# Altium schematic sheet P1.SchDoc
size A2
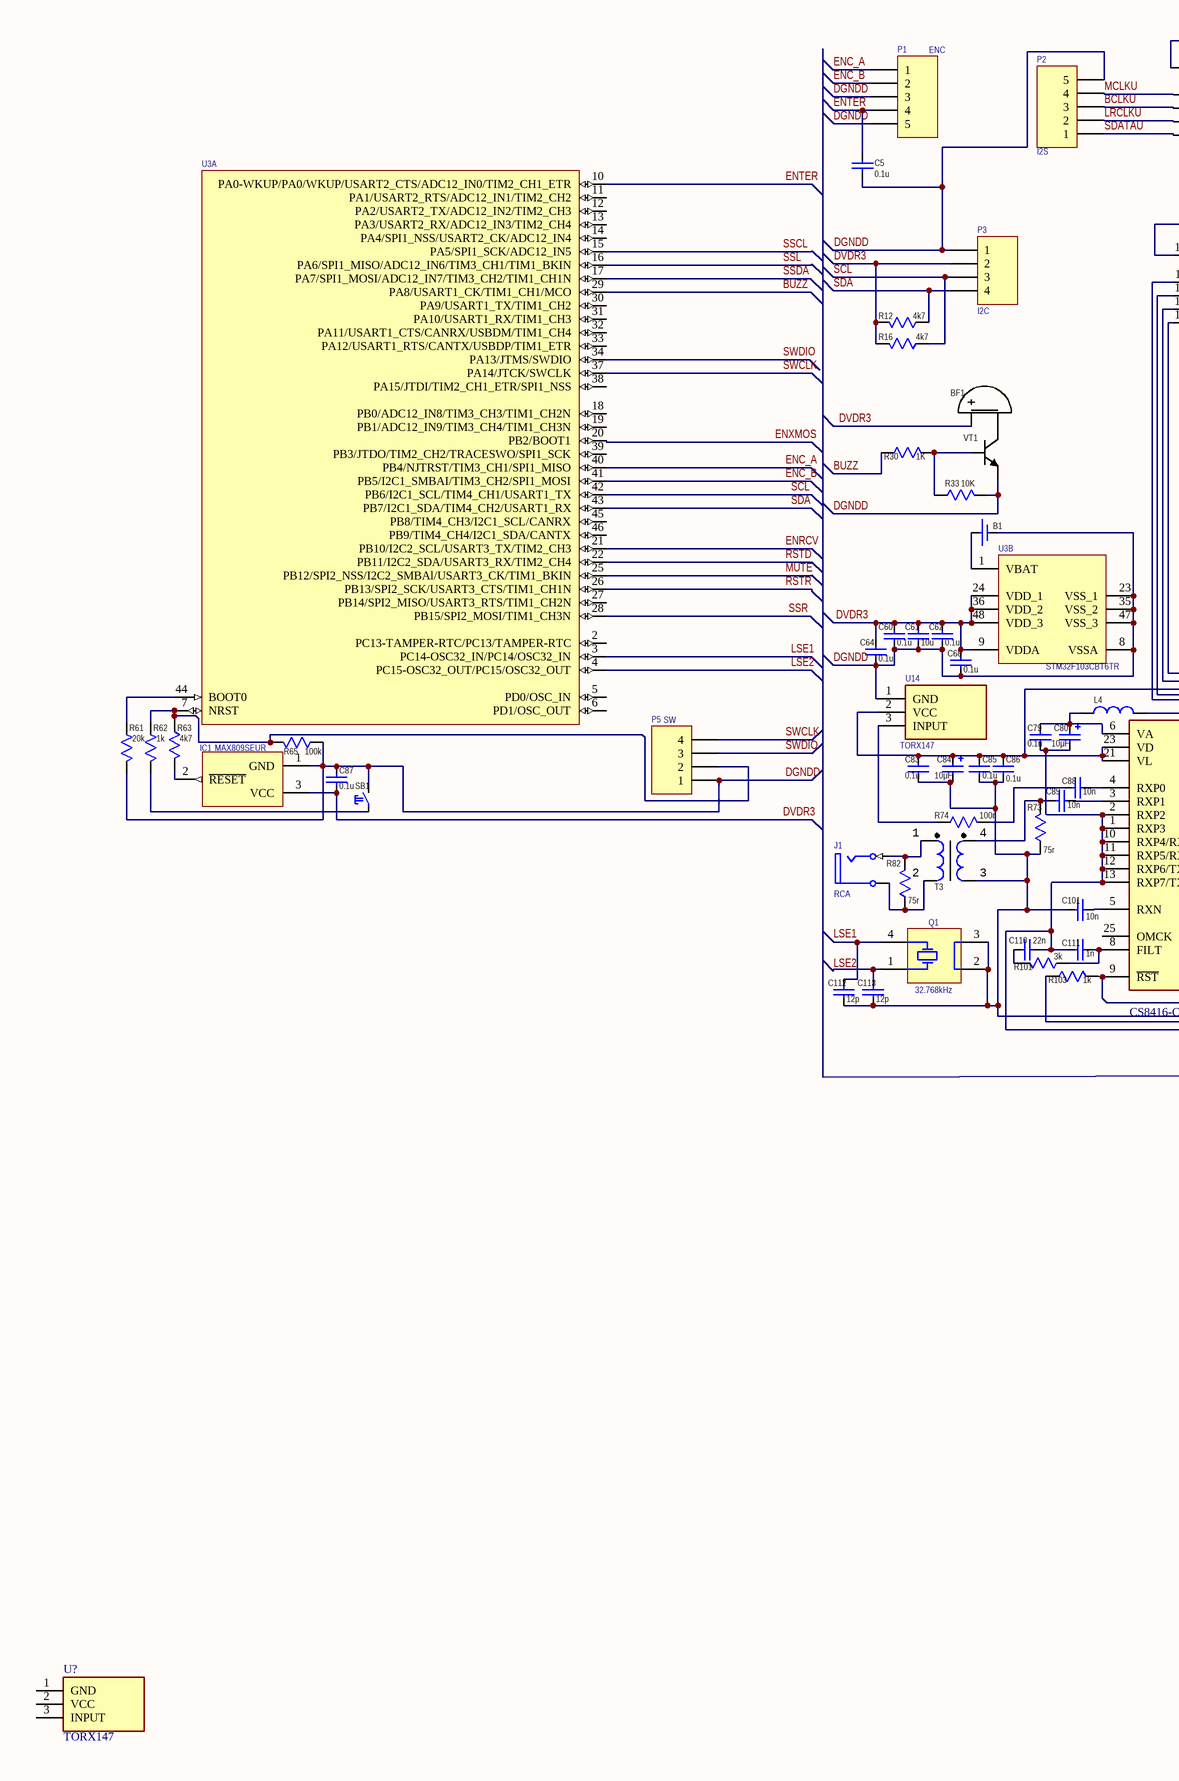
[diagram p0: P1.SchDoc, left]
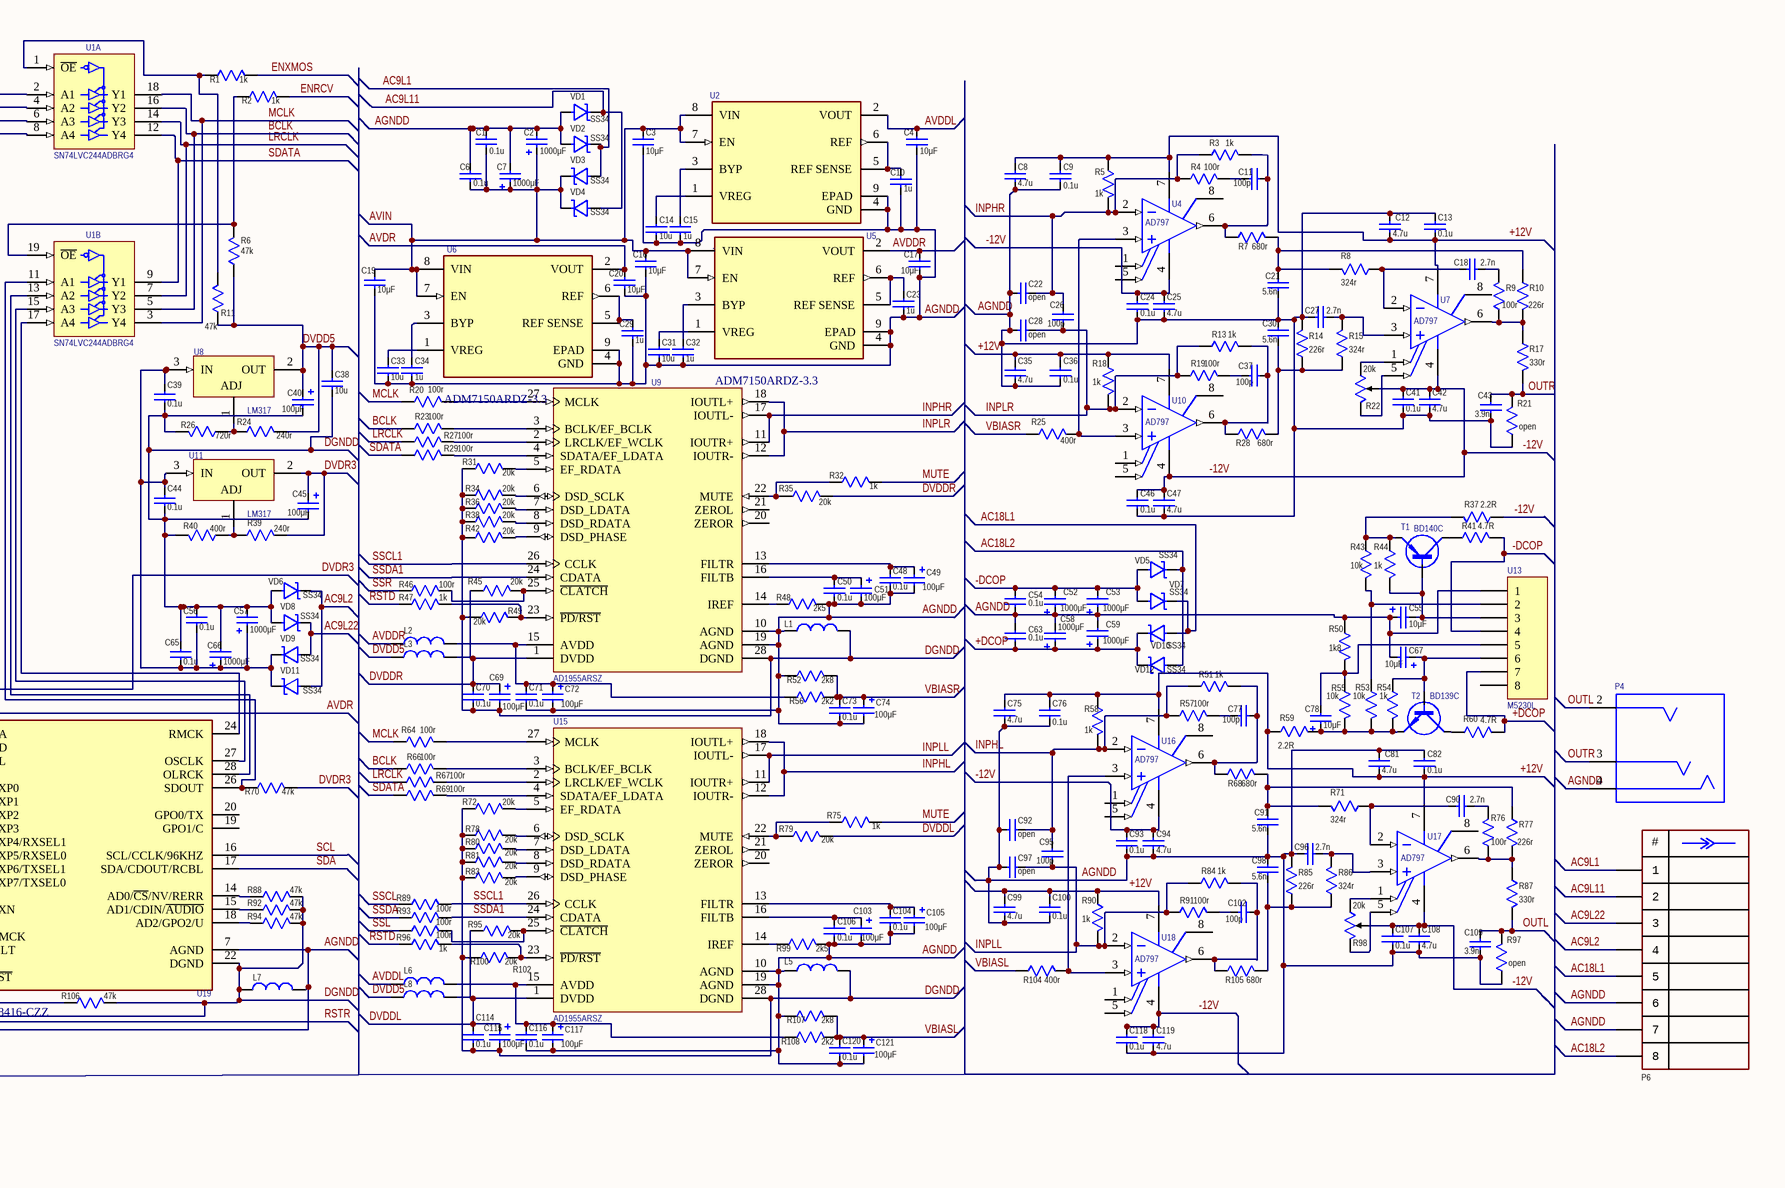
[diagram p1: P1.SchDoc, right]

## Parts
B1  (no value)  [BAT: CH224-2032]
BF1  (no value)  [BUZ: AT-0927-TT-6-R]
C1  value 0.1u  [CAP: 0805]
C2  value 1000μF  [CAP: D10C5H20]
C3  value 10μF  [CAP: 0805]
C4  value 10μF  [CAP: 0805]
C5  value 0.1u  [CAP: 0603]
C6  value 0.1u  [CAP: 0805]
C7  value 1000μF  [CAP: D10C5H20]
C8  value 4.7u  [CAP: 0603]
C9  value 0.1u  [CAP: 0603]
C10  value 1u  [CAP: 0603]
C11  value 100p  [CAP: 0603]
C12  value 4.7u  [CAP: 0603]
C13  value 0.1u  [CAP: 0603]
C14  value 10u  [CAP: 0603]
C15  value 1u  [CAP: 0603]
C16  value 10μF  [CAP: 0805]
C17  value 10μF  [CAP: 0805]
C18  value 2.7n  [CAP: 0603]
C19  value 10μF  [CAP: 0805]
C20  value 10μF  [CAP: 0805]
C21  value 5.6n  [CAP: 0603]
C22  value open  [CAP: 0603]
C23  value 1u  [CAP: 0603]
C24  value 0.1u  [CAP: 0603]
C25  value 4.7u  [CAP: 0603]
C26  value 100p  [CAP: 0603]
C27  value 2.7n  [CAP: 0603]
C28  value open  [CAP: 0603]
C29  value 1u  [CAP: 0603]
C30  value 5.6n  [CAP: 0603]
C31  value 10u  [CAP: 0603]
C32  value 1u  [CAP: 0603]
C33  value 10u  [CAP: 0603]
C34  value 1u  [CAP: 0603]
C35  value 4.7u  [CAP: 0603]
C36  value 0.1u  [CAP: 0603]
C37  value 100p  [CAP: 0603]
C38  value 10u  [CAP: 0603]
C39  value 0.1u  [CAP: 0805]
C40  value 100μF  [CAP: D6.3C2.5H11]
C41  value 0.1u  [CAP: 0603]
C42  value 4.7u  [CAP: 0603]
C43  value 3.9n  [CAP: 0603]
C44  value 0.1u  [CAP: 0805]
C45  value 100μF  [CAP: D6.3C2.5H11]
C46  value 0.1u  [CAP: 0603]
C47  value 4.7u  [CAP: 0603]
C48  value 0.1u  [CAP: 0603]
C49  value 100μF  [CAP: D6.3C2.5H11]
C50  value 0.1u  [CAP: 0603]
C51  value 100μF  [CAP: D6.3C2.5H11]
C52  value 1000μF  [CAP: D10C5H20]
C53  value 1000μF  [CAP: D10C5H20]
C54  value 0.1u  [CAP: 0805]
C55  value 10μF  [CAP: D5C2H11]
C56  value 0.1u  [CAP: 0805]
C57  value 1000μF  [CAP: D10C5H20]
C58  value 1000μF  [CAP: D10C5H20]
C59  value 1000μF  [CAP: D10C5H20]
C60  value 0.1u  [CAP: 0603]
C61  value 10u  [CAP: 0603]
C62  value 0.1u  [CAP: 0603]
C63  value 0.1u  [CAP: 0805]
C64  value 0.1u  [CAP: 0603]
C65  value 0.1u  [CAP: 0805]
C66  value 1000μF  [CAP: D10C5H20]
C67  value 10μF  [CAP: D5C2H11]
C68  value 0.1u  [CAP: 0603]
C69  value 100μF  [CAP: D6.3C2.5H11]
C70  value 0.1u  [CAP: 0603]
C71  value 0.1u  [CAP: 0603]
C72  value 100μF  [CAP: D6.3C2.5H11]
C73  value 0.1u  [CAP: 0603]
C74  value 100μF  [CAP: D6.3C2.5H11]
C75  value 4.7u  [CAP: 0603]
C76  value 0.1u  [CAP: 0603]
C77  value 100p  [CAP: 0603]
C78  value 10μF  [CAP: D5C2H11]
C79  value 0.1u  [CAP: 0603]
C80  value 10μF  [CAP: D5C2H11]
C81  value 4.7u  [CAP: 0603]
C82  value 0.1u  [CAP: 0603]
C83  value 0.1u  [CAP: 0603]
C84  value 10μF  [CAP: D5C2H11]
C85  value 0.1u  [CAP: 0603]
C86  value 0.1u  [CAP: 0603]
C87  value 0.1u  [CAP: 0805]
C88  value 10n  [CAP: 0603]
C89  value 10n  [CAP: 0603]
C90  value 2.7n  [CAP: 0603]
C91  value 5.6n  [CAP: 0603]
C92  value open  [CAP: 0603]
C93  value 0.1u  [CAP: 0603]
C94  value 4.7u  [CAP: 0603]
C95  value 100p  [CAP: 0603]
C96  value 2.7n  [CAP: 0603]
C97  value open  [CAP: 0603]
C98  value 5.6n  [CAP: 0603]
C99  value 4.7u  [CAP: 0603]
C100  value 0.1u  [CAP: 0603]
C101  value 10n  [CAP: 0603]
C102  value 100p  [CAP: 0603]
C103  value 100μF  [CAP: D6.3C2.5H11]
C104  value 0.1u  [CAP: 0603]
C105  value 100μF  [CAP: D6.3C2.5H11]
C106  value 0.1u  [CAP: 0603]
C107  value 0.1u  [CAP: 0603]
C108  value 4.7u  [CAP: 0603]
C109  value 3.9n  [CAP: 0603]
C110  value 22n  [CAP: 0603]
C111  value 1n  [CAP: 0603]
C112  value 12p  [CAP: 0805]
C113  value 12p  [CAP: 0805]
C114  value 0.1u  [CAP: 0603]
C115  value 100μF  [CAP: D6.3C2.5H11]
C116  value 0.1u  [CAP: 0603]
C117  value 100μF  [CAP: D6.3C2.5H11]
C118  value 0.1u  [CAP: 0603]
C119  value 4.7u  [CAP: 0603]
C120  value 0.1u  [CAP: 0603]
C121  value 100μF  [CAP: D6.3C2.5H11]
IC1  MAX809SEUR  [SOT95P230X112-3N]
J1  RCA  [RCA/4.5-H2]
L1  (no value)  [IND: 0805]
L2  (no value)  [IND: 0805]
L3  (no value)  [IND: 0805]
L4  (no value)  [IND: 0805]
L5  (no value)  [IND: 0805]
L6  (no value)  [IND: 0805]
L7  (no value)  [IND: 0805]
L8  (no value)  [IND: 0805]
P1  ENC  [HDR1X5]
P2  I2S  [HDR1X5]
P3  I2C  [HDR1X4]
P4  SJ2-3573A2-SMT-TR  [CUI_SJ2-3573A2-SMT-TR]  (value not drawn)
P5  SW  [HDR1X4]
P6  (no value)  [CON: CWF-8R]
Q1  32.768kHz  [XTAL_EPSON_MC-406]
R1  value 1k  [RES: 0603]
R2  value 1k  [RES: 0603]
R3  value 1k  [RES: 0603]
R4  value 100r  [RES: 0603]
R5  value 1k  [RES: 0603]
R6  value 47k  [RES: 0603]
R7  value 680r  [RES: 0603]
R8  value 324r  [RES: 0603]
R9  value 100r  [RES: 0603]
R10  value 226r  [RES: 0603]
R11  value 47k  [RES: 0603]
R12  value 4k7  [RES: 0603]
R13  value 1k  [RES: 0603]
R14  value 226r  [RES: 0603]
R15  value 324r  [RES: 0603]
R16  value 4k7  [RES: 0603]
R17  value 330r  [RES: 0603]
R18  value 1k  [RES: 0603]
R19  value 100r  [RES: 0603]
R20  value 100r  [RES: 0603]
R21  value open  [RES: 0603]
R22  value 20k  [RES: 3296W]
R23  value 100r  [RES: 0603]
R24  value 240r  [RES: 0603]
R25  value 400r  [RES: 0603]
R26  value 720r  [RES: 0603]
R27  value 100r  [RES: 0603]
R28  value 680r  [RES: 0603]
R29  value 100r  [RES: 0603]
R30  value 1K  [RES: 0603]
R31  value 20k  [RES: 0603]
R32  value 1k  [RES: 0603]
R33  value 10K  [RES: 0603]
R34  value 20k  [RES: 0603]
R35  value 20k  [RES: 0603]
R36  value 20k  [RES: 0603]
R37  value 2.2R  [RES: 1206]
R38  value 20k  [RES: 0603]
R39  value 240r  [RES: 0603]
R40  value 400r  [RES: 0603]
R41  value 4.7R  [RES: 1206]
R42  value 20k  [RES: 0603]
R43  value 10k  [RES: 0603]
R44  value 1k  [RES: 0603]
R45  value 20k  [RES: 0603]
R46  value 100r  [RES: 0603]
R47  value 1k  [RES: 0603]
R48  value 2k5  [RES: 0603]
R49  value 20k  [RES: 0603]
R50  value 1k8  [RES: 0603]
R51  value 1k  [RES: 0603]
R52  value 2k8  [RES: 0603]
R53  value 10k  [RES: 0603]
R54  value 1k  [RES: 0603]
R55  value 10k  [RES: 0603]
R56  value 2k2  [RES: 0603]
R57  value 100r  [RES: 0603]
R58  value 1k  [RES: 0603]
R59  value 2.2R  [RES: 1206]
R60  value 4.7R  [RES: 1206]
R61  value 20k  [RES: 0603]
R62  value 1k  [RES: 0603]
R63  value 4k7  [RES: 0603]
R64  value 100r  [RES: 0603]
R65  value 100k  [RES: 0603]
R66  value 100r  [RES: 0603]
R67  value 100r  [RES: 0603]
R68  value 680r  [RES: 0603]
R69  value 100r  [RES: 0603]
R70  value 47k  [RES: 0603]
R71  value 324r  [RES: 0603]
R72  value 20k  [RES: 0603]
R73  value 75r  [RES: 0603]
R74  value 100r  [RES: 0603]
R75  value 1k  [RES: 0603]
R76  value 100r  [RES: 0603]
R77  value 226r  [RES: 0603]
R78  value 20k  [RES: 0603]
R79  value 20k  [RES: 0603]
R80  value 20k  [RES: 0603]
R81  value 20k  [RES: 0603]
R82  value 75r  [RES: 0603]
R83  value 20k  [RES: 0603]
R84  value 1k  [RES: 0603]
R85  value 226r  [RES: 0603]
R86  value 324r  [RES: 0603]
R87  value 330r  [RES: 0603]
R88  value 47k  [RES: 0603]
R89  value 100r  [RES: 0603]
R90  value 1k  [RES: 0603]
R91  value 100r  [RES: 0603]
R92  value 47k  [RES: 0603]
R93  value 100r  [RES: 0603]
R94  value 47k  [RES: 0603]
R95  value 20k  [RES: 0603]
R96  value 1k  [RES: 0603]
R97  value open  [RES: 0603]
R98  value 20k  [RES: 3296W]
R99  value 2k5  [RES: 0603]
R100  value 20k  [RES: 0603]
R101  value 3k  [RES: 0603]
R102  value 100r  [RES: 0603]
R103  value 1k  [RES: 0603]
R104  value 400r  [RES: 0603]
R105  value 680r  [RES: 0603]
R106  value 47k  [RES: 0603]
R107  value 2k8  [RES: 0603]
R108  value 2k2  [RES: 0603]
SB1  (no value)  [BUT: 6x6 SMD]
T1  BD140C  [TO126V A]
T2  BD139C  [TO126V A]
T3  (no value)  [TRANS: ZMPT107]
U1  SN74LVC244ADBRG4  [SOP65P780X200-20N]  (parts A,B of 2)
U2  ADM7150ARDZ-3.3  [Analog_Devices_Inc_RD-8-2_0]  (value not drawn)
U3  (no value)  [QFP50P900X900X160-48N]  (parts A,B of 2)
U4  AD797  [ADI-R-8_M]
U5  ADM7150ARDZ-3.3  [Analog_Devices_Inc_RD-8-2_0]  (value not drawn)
U6  ADM7150ARDZ-3.3  [Analog_Devices_Inc_RD-8-2_0]  (value not drawn)
U7  AD797  [ADI-R-8_M]
U8  LM317  [TO-220-V]
U9  AD1955ARSZ  [ADI-RS-28_L]
U10  AD797  [ADI-R-8_M]
U11  LM317  [TO-220-V]
U13  M5230L  [HDR1X8]
U14  TORX147  [TORX147]
U15  AD1955ARSZ  [ADI-RS-28_L]
U16  AD797  [ADI-R-8_M]
U17  AD797  [ADI-R-8_M]
U18  AD797  [ADI-R-8_M]
U19  CS8416-CZZ  [Cirrus_Logic_CS8416-CZZ_0]  (value not drawn)
U?  TORX147  [TORX147]
VD1  PartNumber: SS34  [DIODE: SMA]
VD2  PartNumber: SS34  [DIODE: SMA]
VD3  PartNumber: SS34  [DIODE: SMA]
VD4  PartNumber: SS34  [DIODE: SMA]
VD5  PartNumber: SS34  [DIODE: SMA]
VD6  PartNumber: SS34  [DIODE: SMA]
VD7  PartNumber: SS34  [DIODE: SMA]
VD8  PartNumber: SS34  [DIODE: SMA]
VD9  PartNumber: SS34  [DIODE: SMA]
VD10  PartNumber: SS34  [DIODE: SMA]
VD11  PartNumber: SS34  [DIODE: SMA]
VD12  PartNumber: SS34  [DIODE: SMA]
VT1  (no value)  [SOT23]

## Nets
GND: U1.10(GND)
VCC: U1.20(VCC)
+12V: C8.1 C9.1 C12.2 C13.2 C35.1 C36.1 C75.1 C76.1 C81.2 C82.2 C99.1 C100.1 R5.1 R18.1 R58.1 R59.1 R90.1 U4.7(+VS) U7.7(+VS) U10.7(+VS) U16.7(+VS) U17.7(+VS) U18.7(+VS)
+DCOP: C58.1 C59.1 C63.1 R60.2 U13.7 VD10.2 VD12.2
-12V: C24.1 C25.1 C41.1 C42.1 C46.1 C47.1 C93.1 C94.1 C107.1 C108.1 C118.1 C119.1 R22.2 R37.1 R98.2 U4.4(-VS) U7.4(-VS) U10.4(-VS) U16.4(-VS) U17.4(-VS) U18.4(-VS)
-DCOP: C52.2 C53.2 C54.2 R41.2 U13.4 VD5.1 VD7.1
AC9L1: P6.1 VD2.2 VD3.1
AC9L2: P6.4 VD6.2 VD11.1
AC9L11: P6.2 VD1.2 VD4.1
AC9L22: P6.3 VD8.2 VD9.1
AC18L1: P6.5 VD7.2 VD10.1
AC18L2: P6.8 VD5.2 VD12.1
AGNDD: C1.2 C2.2 C3.2 C4.2 C6.2 C7.2 C8.2 C9.2 C10.2 C12.1 C13.1 C14.2 C15.2 C16.2 C17.2 C19.2 C20.2 C21.2 C22.2 C23.2 C24.2 C25.2 C27.1 C28.2 C29.2 C30.1 C31.2 C32.2 C33.2 C34.2 C35.2 C36.2 C41.2 C42.2 C43.1 C46.2 C47.2 C48.2 C49.2 C50.2 C51.2 C52.1 C53.1 C54.1 C55.1 C58.2 C59.2 C63.2 C67.2 C71.2 C72.2 C73.2 C74.2 C75.2 C76.2 C79.1 C80.2 C81.1 C82.1 C91.2 C92.2 C93.2 C94.2 C96.1 C97.2 C98.1 C99.2 C100.2 C103.2 C104.2 C105.2 C106.2 C107.2 C108.2 C109.1 C110.2 C111.1 C116.2 C117.2 C118.2 C119.2 C120.2 C121.2 L1.2 L5.2 L7.1 P4.4(RING2) P6.6 P6.7 R14.2 R21.1 R48.2 R50.1 R52.1 R85.2 R97.1 R99.2 R107.1 U2.4(GND) U2.9(EPAD) U5.4(GND) U5.9(EPAD) U6.4(GND) U6.9(EPAD) U9.10(AGND) U9.19(AGND) U13.1 U15.10(AGND) U15.19(AGND) U19.1(RXP3) U19.2(RXP2) U19.7(AGND) U19.10(RXP4/RXSEL1) U19.11(RXP5/RXSEL0) U19.12(RXP6/TXSEL1) U19.13(RXP7/TXSEL0) VD1.1 VD2.1
AVDDL: C4.1 L6.2 U2.2(VOUT)
AVDDR: C17.1 L2.2 U5.2(VOUT)
AVDR: C20.1 L4.1 U6.2(VOUT)
AVIN: C1.1 C2.1 C3.1 C6.1 C7.1 C16.1 C19.1 U2.7(EN) U2.8(VIN) U5.7(EN) U5.8(VIN) U6.7(EN) U6.8(VIN) VD3.2 VD4.2
BCLK: R23.1 R66.1 U1.5(Y3) U1.16(Y2)
BCLKU: P2.3 U1.4(A2)
BUZZ: R30.1 U3.29(PA8/USART1_CK/TIM1_CH1/MCO)
DGNDD: B1.2(-) C5.2 C38.2 C39.1 C40.2 C44.1 C45.2 C56.2 C57.2 C60.1 C61.2 C62.1 C64.1 C65.2 C66.2 C68.1 C69.2 C70.2 C83.1 C84.2 C85.1 C86.1 C87.2 C101.1 C112.1 C113.1 C114.2 C115.2 IC1.1(GND) L1.1 L5.1 L7.2 P1.3 P1.5 P2.5 P3.1 P5.1 Q1.2(GND) Q1.3(GND) R26.2 R31.1 R33.2 R34.1 R36.1 R38.1 R40.2 R42.1 R49.1 R61.2 R65.1 R72.1 R73.1 R78.1 R80.1 R81.1 R83.1 R88.2 R92.2 R94.2 R100.1 R106.2 SB1.2 T3.3 U3.8(VSSA) U3.23(VSS_1) U3.35(VSS_2) U3.47(VSS_3) U9.28(DGND) U14.1(GND) U15.28(DGND) U19.22(DGND) VD6.1 VD8.1 VT1.2(E)
DVDD5: C38.1 C40.1 L3.2 L8.2 R6.1 R11.1 R24.2 U8.2(OUT)
DVDDL: C114.1 C115.1 L8.1 R79.2 R95.1 U15.1(DVDD)
DVDDR: C69.1 C70.1 L3.1 R35.2 R45.1 U9.1(DVDD)
DVDR3: BF1.1(+) C45.1 C60.2 C61.1 C62.2 C64.2 C68.2 C83.2 C84.1 C85.2 C86.2 C87.1 IC1.3(VCC) P3.2 R12.2 R16.2 R39.2 R70.2 U3.9(VDDA) U3.24(VDD_1) U3.36(VDD_2) U3.48(VDD_3) U11.2(OUT) U14.2(VCC) U19.21(VL) U19.23(VD)
ENC_A: P1.1 U3.40(PB4/NJTRST/TIM3_CH1/SPI1_MISO)
ENC_B: P1.2 U3.41(PB5/I2C1_SMBAI/TIM3_CH2/SPI1_MOSI)
ENRCV: R2.2 U3.21(PB10/I2C2_SCL/USART3_TX/TIM2_CH3)
ENTER: C5.1 P1.4 U3.10(PA0-WKUP/PA0/WKUP/USART2_CTS/ADC12_IN0/TIM2_CH1_ETR)
ENXMOS: R1.2 U3.20(PB2/BOOT1)
INPHL: C92.1 C95.2 R51.1 R57.1 R58.2 U15.12(IOUTR-) U15.18(IOUTL+) U16.2(-IN)
INPHR: C22.1 C26.2 R3.1 R4.1 R5.2 U4.2(-IN) U9.11(IOUTR+) U9.17(IOUTL-)
INPLL: C95.1 C97.1 R84.1 R90.2 R91.1 U15.11(IOUTR+) U15.17(IOUTL-) U18.2(-IN)
INPLR: C26.1 C28.1 R13.1 R18.2 R19.1 U9.12(IOUTR-) U9.18(IOUTL+) U10.2(-IN)
LRCLK: R27.1 R67.1 U1.7(Y2) U1.14(Y3)
LRCLKU: P2.2 U1.6(A3)
LSE1: C112.2 Q1.4(X) U3.3(PC14-OSC32_IN/PC14/OSC32_IN)
LSE2: C113.2 Q1.1(X) U3.4(PC15-OSC32_OUT/PC15/OSC32_OUT)
MCLK: R20.1 R64.1 U1.3(Y4) U1.18(Y1)
MCLKU: P2.4 U1.2(A1)
MUTE: R32.2 R75.2 U3.25(PB12/SPI2_NSS/I2C2_SMBAl/USART3_CK/TIM1_BKIN)
OUTL: C109.2 P4.2(TIP) R87.2 R97.2
OUTR: C43.2 P4.3(RING1) R17.2 R21.2
RSTD: R47.1 R96.1 U3.22(PB11/I2C2_SDA/USART3_RX/TIM2_CH4)
RSTR: R103.1 U3.26(PB13/SPI2_SCK/USART3_CTS/TIM1_CH1N)
SCL: P3.3 R16.1 U3.42(PB6/I2C1_SCL/TIM4_CH1/USART1_TX) U19.16(SCL/CCLK/96KHZ)
SDA: P3.4 R12.1 U3.43(PB7/I2C1_SDA/TIM4_CH2/USART1_RX) U19.17(SDA/CDOUT/RCBL)
SDATA: R29.1 R69.1 U1.9(Y1) U1.12(Y4)
SDATAU: P2.1 U1.8(A4)
SSCL: R89.1 U3.15(PA5/SPI1_SCK/ADC12_IN5)
SSCL1: R89.2 U9.26(CCLK) U15.26(CCLK)
SSDA: R93.1 U3.17(PA7/SPI1_MOSI/ADC12_IN7/TIM3_CH2/TIM1_CH1N)
SSDA1: R93.2 U9.24(CDATA) U15.24(CDATA)
SSL: R102.1 U3.16(PA6/SPI1_MISO/ADC12_IN6/TIM3_CH1/TIM1_BKIN)
SSR: R46.1 U3.28(PB15/SPI2_MOSI/TIM1_CH3N)
SWCLK: P5.4 U3.37(PA14/JTCK/SWCLK)
SWDIO: P5.3 U3.34(PA13/JTMS/SWDIO)
VBIASL: C120.1 C121.1 R104.1 R107.2 R108.2
VBIASR: C73.1 C74.1 R25.1 R52.2 R56.2
NetB1_1: B1.1(+) U3.1(VBAT)
NetBF1_2: BF1.2(-) VT1.3(C)
NetC10_1: C10.1 U2.5(REF_SENSE) U2.6(REF)
NetC11_1: C11.1 R3.2 R7.1 U4.6(OUT)
NetC11_2: C11.2 R4.2
NetC14_1: C14.1 U2.1(VREG)
NetC15_1: C15.1 U2.3(BYP)
NetC18_1: C18.1 R8.1 U7.2(-IN)
NetC18_2: C18.2 R9.2
NetC21_1: C21.1 R7.2 R8.2 R10.1
NetC23_1: C23.1 U5.5(REF_SENSE) U5.6(REF)
NetC27_2: C27.2 R15.2 U7.3(+IN)
NetC29_1: C29.1 U6.5(REF_SENSE) U6.6(REF)
NetC30_2: C30.2 R14.1 R15.1 R28.2
NetC31_1: C31.1 U5.1(VREG)
NetC32_1: C32.1 U5.3(BYP)
NetC33_1: C33.1 U6.1(VREG)
NetC34_1: C34.1 U6.3(BYP)
NetC37_1: C37.1 R13.2 R28.1 U10.6(OUT)
NetC37_2: C37.2 R19.2
NetC39_2: C39.2 C44.2 C56.1 C57.1 C65.1 C66.1 U8.3(IN) U11.3(IN) VD9.2 VD11.2
NetC48_1: C48.1 C49.1 U9.13(FILTR)
NetC50_1: C50.1 C51.1 U9.16(FILTB)
NetC55_2: C55.2 R44.2 T1.3(B) U13.3
NetC67_1: C67.1 R54.1 T2.3(B) U13.6
NetC71_1: C71.1 C72.1 L2.1 R56.1 U9.15(AVDD)
NetC77_1: C77.1 R51.2 R68.1 U16.6(OUT)
NetC77_2: C77.2 R57.2
NetC78_1: C78.1 R53.2 R54.2 R55.2 R59.2 T2.1(E)
NetC78_2: C78.2 R50.2 R55.1 U13.5
NetC79_2: C79.2 C80.1 L4.2 U19.6(VA)
NetC88_1: C88.1 R74.2
NetC88_2: C88.2 U19.4(RXP0)
NetC89_1: C89.1 R73.2 T3.4
NetC89_2: C89.2 U19.3(RXP1)
NetC90_1: C90.1 R71.1 U17.2(-IN)
NetC90_2: C90.2 R76.2
NetC91_1: C91.1 R68.2 R71.2 R77.1
NetC96_2: C96.2 R86.2 U17.3(+IN)
NetC98_2: C98.2 R85.1 R86.1 R105.2
NetC101_2: C101.2 U19.5(RXN)
NetC102_1: C102.1 R84.2 R105.1 U18.6(OUT)
NetC102_2: C102.2 R91.2
NetC103_1: C103.1 C106.1 U15.16(FILTB)
NetC104_1: C104.1 C105.1 U15.13(FILTR)
NetC110_1: C110.1 R101.2
NetC111_2: C111.2 R101.1 U19.8(FILT)
NetC116_1: C116.1 C117.1 L6.1 R108.1 U15.15(AVDD)
NetIC1_2: IC1.2(~{RESET}) R63.2
NetJ1_1A: J1.1A(Ground) R82.1 T3.2
NetJ1_2B: J1.2B(Signal) R82.2 T3.1
NetP5_2: P5.2 R62.1 R63.1 R65.2 U3.7(NRST)
NetR1_1: R1.1 R11.2 U1.1(~{OE})
NetR2_1: R2.1 R6.2 U1.19(~{OE})
NetR9_1: R9.1 R10.2 R17.1 U7.6(OUT)
NetR20_2: R20.2 U9.27(MCLK)
NetR22_1: R22.1 U7.1(OFFSET_NULL)
NetR22_3: R22.3 U7.5(OFFSET_NULL)
NetR23_2: R23.2 U9.3(BCLK/EF_BCLK)
NetR24_1: R24.1 R26.1 U8.1(ADJ)
NetR25_2: R25.2 U4.3(+IN) U10.3(+IN)
NetR27_2: R27.2 U9.2(LRCLK/EF_WCLK)
NetR29_2: R29.2 U9.4(SDATA/EF_LDATA)
NetR30_2: R30.2 R33.1 VT1.1(B)
NetR31_2: R31.2 U9.5(EF_RDATA)
NetR32_1: R32.1 R35.1 U9.22(MUTE)
NetR34_2: R34.2 U9.6(DSD_SCLK)
NetR36_2: R36.2 U9.7(DSD_LDATA)
NetR37_2: R37.2 R43.1 R44.1 T1.1(E)
NetR38_2: R38.2 U9.8(DSD_RDATA)
NetR39_1: R39.1 R40.1 U11.1(ADJ)
NetR41_1: R41.1 T1.2(C)
NetR42_2: R42.2 U9.9(DSD_PHASE)
NetR43_2: R43.2 R53.1 U13.2
NetR45_2: R45.2 R46.2 U9.25(~{CLATCH})
NetR47_2: R47.2 R49.2 U9.23(~{PD/RST})
NetR48_1: R48.1 U9.14(IREF)
NetR60_1: R60.1 T2.2(C)
NetR61_1: R61.1 U3.44(BOOT0)
NetR62_2: R62.2 SB1.1
NetR64_2: R64.2 U15.27(MCLK)
NetR66_2: R66.2 U15.3(BCLK/EF_BCLK)
NetR67_2: R67.2 U15.2(LRCLK/EF_WCLK)
NetR69_2: R69.2 U15.4(SDATA/EF_LDATA)
NetR70_1: R70.1 U1.11(A1) U19.26(SDOUT)
NetR72_2: R72.2 U15.5(EF_RDATA)
NetR74_1: R74.1 U14.3(INPUT)
NetR75_1: R75.1 R79.1 U15.22(MUTE)
NetR76_1: R76.1 R77.2 R87.1 U17.6(OUT)
NetR78_2: R78.2 U15.6(DSD_SCLK)
NetR80_2: R80.2 U15.7(DSD_LDATA)
NetR81_2: R81.2 U15.8(DSD_RDATA)
NetR83_2: R83.2 U15.9(DSD_PHASE)
NetR88_1: R88.1 U19.14(AD0/~{CS}/NV/RERR)
NetR92_1: R92.1 U19.15(AD1/CDIN/~{AUDIO})
NetR94_1: R94.1 U19.18(AD2/GPO2/U)
NetR95_2: R95.2 R102.2 U15.25(~{CLATCH})
NetR96_2: R96.2 R100.2 U15.23(~{PD/RST})
NetR98_1: R98.1 U17.1(OFFSET_NULL)
NetR98_3: R98.3 U17.5(OFFSET_NULL)
NetR99_1: R99.1 U15.14(IREF)
NetR103_2: R103.2 R106.1 U19.9(~{RST})
NetR104_2: R104.2 U16.3(+IN) U18.3(+IN)
NetU1_13: U1.13(A2) U19.28(OLRCK)
NetU1_15: U1.15(A3) U19.27(OSCLK)
NetU1_17: U1.17(A4) U19.24(RMCK)

Not connected (* = marked no-connect by the designer): U3 2(PC13-TAMPER-RTC/PC13/TAMPER-RTC) 5(PD0/OSC_IN) 6(PD1/OSC_OUT) 11(PA1/USART2_RTS/ADC12_IN1/TIM2_CH2) 12(PA2/USART2_TX/ADC12_IN2/TIM2_CH3) 13(PA3/USART2_RX/ADC12_IN3/TIM2_CH4) 14(PA4/SPI1_NSS/USART2_CK/ADC12_IN4) 18(PB0/ADC12_IN8/TIM3_CH3/TIM1_CH2N) 19(PB1/ADC12_IN9/TIM3_CH4/TIM1_CH3N) 27(PB14/SPI2_MISO/USART3_RTS/TIM1_CH2N) 30(PA9/USART1_TX/TIM1_CH2) 31(PA10/USART1_RX/TIM1_CH3) 32(PA11/USART1_CTS/CANRX/USBDM/TIM1_CH4) 33(PA12/USART1_RTS/CANTX/USBDP/TIM1_ETR) 38(PA15/JTDI/TIM2_CH1_ETR/SPI1_NSS) 39(PB3/JTDO/TIM2_CH2/TRACESWO/SPI1_SCK) 45(PB8/TIM4_CH3/I2C1_SCL/CANRX) 46(PB9/TIM4_CH4/I2C1_SDA/CANTX); U4 1(OFFSET_NULL) 5(OFFSET_NULL) 8(DECOMPENSATION_AND_DISTORTION_NEUTRALIZATION); U7 8(DECOMPENSATION_AND_DISTORTION_NEUTRALIZATION); U9 20(ZEROR) 21(ZEROL); U10 1(OFFSET_NULL) 5(OFFSET_NULL) 8(DECOMPENSATION_AND_DISTORTION_NEUTRALIZATION); U13 8; U15 20(ZEROR) 21(ZEROL); U16 1(OFFSET_NULL) 5(OFFSET_NULL) 8(DECOMPENSATION_AND_DISTORTION_NEUTRALIZATION); U17 8(DECOMPENSATION_AND_DISTORTION_NEUTRALIZATION); U18 1(OFFSET_NULL) 5(OFFSET_NULL) 8(DECOMPENSATION_AND_DISTORTION_NEUTRALIZATION); U19 19(GPO1/C) 20(GPO0/TX) 25(OMCK); U? 1(GND) 2(VCC) 3(INPUT)

## Notes on the sheet
- (in symbol CWF-8) #

## Library data of the parts
B1 = Connector_CH224-2032: Manufacturer: KLS; ValueManufacturerPartNumber: Single battery CR2032; CommentText: CR2032; HelpURL: https://www.chipdip.ru/product/bh-642; TypeConnector: Single battery CR2032; PartNumber: CH224-2032
BF1 = Buzzer: Manufacturer: PUI Audio; ValueManufacturerPartNumber: DIP switch, 2.73 kHz, 3VDC, 80mA, -20...+70°C; PartNumber: AT-0927-TT-6-R; TypeBuzzer: DIP switch; VoltageMax: 3VDC; Frequency: 2.73 kHz; CurrentMax: 80mA; HelpURL: https://www.digikey.com/products/en?keywords=AT-0927-TT-6-R; Temperature: -20...+70°C
C1 C5 C6 C9 C13 C24 C36 C39 C41 C44 C46 C48 C50 C54 C56 C60 C62-C65 C68 C70 C71 C73 C76 C79 C82 C83 C85-C87 C93 C100 C104 C106 C107 C114 C116 C118 C120 = Ceramic: Manufacturer: Yageo; PartNumber: CC0201KRX7R7BB103; ValueManufacturerPartNumber: Ceramic capacitor, 0.1u, X7R, ±10%, 16V, 0201, -55...+125°C; TypeCapacitor: Ceramic capacitor; Tolerance: ±10%; TypeDielectric: X7R; Voltage: 16V; Package: 0201; HelpURL: https://www.digikey.com/product-detail/en/yageo/CC0201KRX7R7BB103/311-1404-1-ND/2833710; Temperature: -55...+125°C
C2 C7 C52 C53 C57-C59 C66 = Aluminium: Manufacturer: Wurth; PartNumber: 860080475013; ValueManufacturerPartNumber: Aluminium capacitor, 1000μF, 35V, ±20%, 54mOhm, 14x10x5 mm, -55...+105°C; TypeCapacitor: Aluminium capacitor; Tolerance: ±20%; Impedance: 54mOhm; Voltage: 35V; Package: 14x10x5 mm; HelpURL: https://www.digikey.com/product-detail/en/wurth-electronics-inc/860080475013/732-9029-1-ND/5728972; Temperature: -55...+105°C
C3 C4 C16 C17 C19 C20 = Ceramic: Manufacturer: Yageo; PartNumber: CC0201KRX7R7BB103; ValueManufacturerPartNumber: Ceramic capacitor, 10μF, X7R, ±10%, 16V, 0201, -55...+125°C; TypeCapacitor: Ceramic capacitor; Tolerance: ±10%; TypeDielectric: X7R; Voltage: 16V; Package: 0201; HelpURL: https://www.digikey.com/product-detail/en/yageo/CC0201KRX7R7BB103/311-1404-1-ND/2833710; Temperature: -55...+125°C
C8 C12 C25 C35 C42 C47 C75 C81 C94 C99 C108 C119 = Ceramic: Manufacturer: Yageo; PartNumber: CC0201KRX7R7BB103; ValueManufacturerPartNumber: Ceramic capacitor, 4.7u, X7R, ±10%, 16V, 0201, -55...+125°C; TypeCapacitor: Ceramic capacitor; Tolerance: ±10%; TypeDielectric: X7R; Voltage: 16V; Package: 0201; HelpURL: https://www.digikey.com/product-detail/en/yageo/CC0201KRX7R7BB103/311-1404-1-ND/2833710; Temperature: -55...+125°C
C10 C15 C23 C29 C32 C34 = Ceramic: Manufacturer: Yageo; PartNumber: CC0201KRX7R7BB103; ValueManufacturerPartNumber: Ceramic capacitor, 1u, X7R, ±10%, 16V, 0201, -55...+125°C; TypeCapacitor: Ceramic capacitor; Tolerance: ±10%; TypeDielectric: X7R; Voltage: 16V; Package: 0201; HelpURL: https://www.digikey.com/product-detail/en/yageo/CC0201KRX7R7BB103/311-1404-1-ND/2833710; Temperature: -55...+125°C
C11 C26 C37 C77 C95 C102 = Ceramic: Manufacturer: Yageo; PartNumber: CC0201KRX7R7BB103; ValueManufacturerPartNumber: Ceramic capacitor, 100p, X7R, ±10%, 16V, 0201, -55...+125°C; TypeCapacitor: Ceramic capacitor; Tolerance: ±10%; TypeDielectric: X7R; Voltage: 16V; Package: 0201; HelpURL: https://www.digikey.com/product-detail/en/yageo/CC0201KRX7R7BB103/311-1404-1-ND/2833710; Temperature: -55...+125°C
C14 C31 C33 C38 C61 = Ceramic: Manufacturer: Yageo; PartNumber: CC0201KRX7R7BB103; ValueManufacturerPartNumber: Ceramic capacitor, 10u, X7R, ±10%, 16V, 0201, -55...+125°C; TypeCapacitor: Ceramic capacitor; Tolerance: ±10%; TypeDielectric: X7R; Voltage: 16V; Package: 0201; HelpURL: https://www.digikey.com/product-detail/en/yageo/CC0201KRX7R7BB103/311-1404-1-ND/2833710; Temperature: -55...+125°C
C18 C27 C90 C96 = Ceramic: Manufacturer: Yageo; PartNumber: CC0201KRX7R7BB103; ValueManufacturerPartNumber: Ceramic capacitor, 2.7n, X7R, ±10%, 16V, 0201, -55...+125°C; TypeCapacitor: Ceramic capacitor; Tolerance: ±10%; TypeDielectric: X7R; Voltage: 16V; Package: 0201; HelpURL: https://www.digikey.com/product-detail/en/yageo/CC0201KRX7R7BB103/311-1404-1-ND/2833710; Temperature: -55...+125°C
C21 C30 C91 C98 = Ceramic: Manufacturer: Yageo; PartNumber: CC0201KRX7R7BB103; ValueManufacturerPartNumber: Ceramic capacitor, 5.6n, X7R, ±10%, 16V, 0201, -55...+125°C; TypeCapacitor: Ceramic capacitor; Tolerance: ±10%; TypeDielectric: X7R; Voltage: 16V; Package: 0201; HelpURL: https://www.digikey.com/product-detail/en/yageo/CC0201KRX7R7BB103/311-1404-1-ND/2833710; Temperature: -55...+125°C
C22 C28 C92 C97 = Ceramic: Manufacturer: Yageo; PartNumber: CC0201KRX7R7BB103; ValueManufacturerPartNumber: Ceramic capacitor, open, X7R, ±10%, 16V, 0201, -55...+125°C; TypeCapacitor: Ceramic capacitor; Tolerance: ±10%; TypeDielectric: X7R; Voltage: 16V; Package: 0201; HelpURL: https://www.digikey.com/product-detail/en/yageo/CC0201KRX7R7BB103/311-1404-1-ND/2833710; Temperature: -55...+125°C
C40 C45 C49 C51 C69 C72 C74 C103 C105 C115 C117 C121 = Aluminium: Manufacturer: Wurth; PartNumber: 860080475013; ValueManufacturerPartNumber: Aluminium capacitor, 100μF, 25V, ±20%, 54mOhm, 14x10x5 mm, -55...+105°C; TypeCapacitor: Aluminium capacitor; Tolerance: ±20%; Impedance: 54mOhm; Voltage: 25V; Package: 14x10x5 mm; HelpURL: https://www.digikey.com/product-detail/en/wurth-electronics-inc/860080475013/732-9029-1-ND/5728972; Temperature: -55...+105°C
C43 C109 = Ceramic: Manufacturer: Yageo; PartNumber: CC0201KRX7R7BB103; ValueManufacturerPartNumber: Ceramic capacitor, 3.9n, X7R, ±10%, 16V, 0201, -55...+125°C; TypeCapacitor: Ceramic capacitor; Tolerance: ±10%; TypeDielectric: X7R; Voltage: 16V; Package: 0201; HelpURL: https://www.digikey.com/product-detail/en/yageo/CC0201KRX7R7BB103/311-1404-1-ND/2833710; Temperature: -55...+125°C
C55 C67 C78 C80 C84 = Aluminium: Manufacturer: Wurth; PartNumber: 860080475013; ValueManufacturerPartNumber: Aluminium capacitor, 10μF, 50V, ±20%, 54mOhm, 14x10x5 mm, -55...+105°C; TypeCapacitor: Aluminium capacitor; Tolerance: ±20%; Impedance: 54mOhm; Voltage: 50V; Package: 14x10x5 mm; HelpURL: https://www.digikey.com/product-detail/en/wurth-electronics-inc/860080475013/732-9029-1-ND/5728972; Temperature: -55...+105°C
C88 C89 C101 = Ceramic: Manufacturer: Yageo; PartNumber: CC0201KRX7R7BB103; ValueManufacturerPartNumber: Ceramic capacitor, 10n, X7R, ±10%, 16V, 0201, -55...+125°C; TypeCapacitor: Ceramic capacitor; Tolerance: ±10%; TypeDielectric: X7R; Voltage: 16V; Package: 0201; HelpURL: https://www.digikey.com/product-detail/en/yageo/CC0201KRX7R7BB103/311-1404-1-ND/2833710; Temperature: -55...+125°C
C110 = Ceramic: Manufacturer: Yageo; PartNumber: CC0201KRX7R7BB103; ValueManufacturerPartNumber: Ceramic capacitor, 22n, X7R, ±10%, 16V, 0201, -55...+125°C; TypeCapacitor: Ceramic capacitor; Tolerance: ±10%; TypeDielectric: X7R; Voltage: 16V; Package: 0201; HelpURL: https://www.digikey.com/product-detail/en/yageo/CC0201KRX7R7BB103/311-1404-1-ND/2833710; Temperature: -55...+125°C
C111 = Ceramic: Manufacturer: Yageo; PartNumber: CC0201KRX7R7BB103; ValueManufacturerPartNumber: Ceramic capacitor, 1n, X7R, ±10%, 16V, 0201, -55...+125°C; TypeCapacitor: Ceramic capacitor; Tolerance: ±10%; TypeDielectric: X7R; Voltage: 16V; Package: 0201; HelpURL: https://www.digikey.com/product-detail/en/yageo/CC0201KRX7R7BB103/311-1404-1-ND/2833710; Temperature: -55...+125°C
C112 C113 = Ceramic: Manufacturer: Yageo; PartNumber: CC0201KRX7R7BB103; ValueManufacturerPartNumber: Ceramic capacitor, 12p, X7R, ±10%, 16V, 0201, -55...+125°C; TypeCapacitor: Ceramic capacitor; Tolerance: ±10%; TypeDielectric: X7R; Voltage: 16V; Package: 0201; HelpURL: https://www.digikey.com/product-detail/en/yageo/CC0201KRX7R7BB103/311-1404-1-ND/2833710; Temperature: -55...+125°C
IC1 = MAX809MEUR: 3-Pin Microprocessor Reset Circuit; Part Description: 3-Pin Microprocessor Reset Circuit (Reset Threshold 4.38V); Manufacturer: MAXIM; PressFit: No; Bonding: No; Part Number: MAX809SEUR; Component Kind: Standard; Component Type: Standard; Device: MAX809SEUR; PackageDescription: SOT23 3-Leads, Pitch 0.95mm - Body 1.3x2.86mm, IPC Medium Density; Manufacturer Part Number: MAX809SEUR; Pin Count: 3; Case: SOT23; Mounted: Yes; Socket: No; SMD: Yes; Sense: No; ComponentHeight: 1.12mm; HelpURL: \\cern.ch\dfs\Applications\Altium\Datasheets\MAX809MEUR.pdf; Author: CERN DEM JLC; CreateDate: 23.08.2012; LatestRevisionDate: 23.08.2012
J1 = RCA: RCA Phono Jack, Right Angle, Thru-Hole, Snap-In; PCB_Layout: Complies with manufacturer's recommendation.; DrillAndSlotSize: Corresponds to nominal value.; Published: 15-Jul-2004; LatestRevisionDate: 15-Jul-2004; LatestRevisionNote: Component Replaced.; DatasheetDocument: 7-Jul-2000; PackageDocument: 7-Jul-2000; PackageReference: 161; Publisher: Altium Limited; ComponentLink1Description: Manufacturer Link; ComponentLink1URL: http://www.mouser.com/kobiconn/
L1-L8 = Inductor_SMD: Manufacturer: Murata Electronics; PartNumber: LQP03TNR10J02D; ValueManufacturerPartNumber: Fixed inductor, 100nH, ±5%, 0201, 80mA, -55...+125°C; TypeInductor: Fixed inductor; MaxCurrent: 80mA; Tolerance: ±5%; Value: 100nH; Package: 0201; HelpURL: https://www.digikey.com/product-detail/en/murata-electronics-north-america/LQP03TNR10J02D/490-6742-1-ND/3845939; Temperature: -55...+125°C
P1 P2 = Header 5: Header, 5-Pin; LatestRevisionDate: 17-Jul-2002; LatestRevisionNote: Re-released for DXP Platform.; Publisher: Altium Limited
P3 P5 = Header 4: Header, 4-Pin; LatestRevisionDate: 17-Jul-2002; LatestRevisionNote: Re-released for DXP Platform.; Publisher: Altium Limited
P4 = SJ2-3573A2-SMT-TR: 3.5 mm, Stereo, Right Angle, Surface Mount _SMT_, Audio Jack Connector; MF: CUI Devices; Value: *; MP: SJ2-3573A2-SMT-TR; SnapEDA_Link: https://www.snapeda.com/parts/SJ2-3573A2-SMT-TR/CUI%20Devices/view-part/701785/?ref=snap; Package: None; Digi-Key_Part_Number: CP-SJ2-3573A2-SMT-CT-ND; Digi-Key_Purchase_URL: https://www.digikey.com.tr/product-detail/en/cui-devices/SJ2-3573A2-SMT-TR/CP-SJ2-3573A2-SMT-CT-ND/6619610?utm_source=snapeda&utm_medium=aggregator&utm_campaign=symbol; CUI_purchase_URL: https://www.cuidevices.com/product/interconnect/connectors/audio-connectors/jacks/sj2-357x-smt-series?utm_source=snapeda.com&utm_medium=referral&utm_campaign=snapedaBOM
P6 = CWF-8: Manufacturer: Connfly; ValueManufacturerPartNumber: Connector, 8pin, 2.5mm, 250VAC, 3A; TypeConnector: Connector; VoltageMax: 250VAC; Pitch: 2.5mm; CurrentMax: 3A; Multichannel: 8pin; CommentText: "Разъем"; HelpURL: https://www.chipdip.ru/product/cwf-8; PartNumber: CWF-8
Q1 = XTAL_32.768KHZ_EPSON_MC-406 32.768K-A3:ROHS: Crystal 4 pins 1=XTAL Control 2 And 3=NC 4=XTAL; Part Description: Load capacitance 12.5pF, Frequency Tolerance ±20 ppm, 40°C to 85°C, Surface Mount Quartz Crystal, MC-406 Series; Manufacturer: EPSON TOYOCOM; PressFit: No; Bonding: No; Part Number: XTAL_32.768KHZ_EPSON_MC-406 32.768K-A3:ROHS; Component Kind: Standard; Component Type: Standard; PackageDescription: EPSON Crystal; 10.41mm L X 4.06mm W X 3.6mm H; Value: 32.768kHz; Manufacturer Part Number: MC-406 32.768K-A3:ROHS; Pin Count: 4; Mounted: Yes; Socket: No; SMD: Yes; Sense: No; ComponentHeight: 3.6mm; HelpURL: \\cern.ch\dfs\Applications\Altium\Datasheets\XTAL_EPSON_MC-406.pdf; ComponentLink1URL: \\cern.ch\dfs\Applications\Altium\Datasheets\XTAL_EPSON_MC-406_Ordering-Informations.pdf; ComponentLink1Description: Ordering Informations; Author: CERN DEM JLC; CreateDate: 27.03.2012; LatestRevisionDate: 30.01.2013
R1-R3 R5 R13 R18 R32 R44 R47 R51 R54 R58 R62 R75 R84 R90 R96 R103 = Resistor: Manufacturer: Yageo; PartNumber: RC0201JR-07100RL; ValueManufacturerPartNumber: Resistor film, 1k, ±5%, 0201, 0.05W, -55...+125°C; TypeResistor: Resistor film; Power: 0.05W; Tolerance: ±5%; Package: 0201; HelpURL: https://www.digikey.com/product-detail/en/yageo/RC0201JR-07100RL/311-100NCT-ND/1949006; Temperature: -55...+125°C
R4 R9 R19 R20 R23 R27 R29 R46 R57 R64 R66 R67 R69 R74 R76 R89 R91 R93 R102 = Resistor: Manufacturer: Yageo; PartNumber: RC0201JR-07100RL; ValueManufacturerPartNumber: Resistor film, 100r, ±5%, 0201, 0.05W, -55...+125°C; TypeResistor: Resistor film; Power: 0.05W; Tolerance: ±5%; Package: 0201; HelpURL: https://www.digikey.com/product-detail/en/yageo/RC0201JR-07100RL/311-100NCT-ND/1949006; Temperature: -55...+125°C
R6 R11 R70 R88 R92 R94 R106 = Resistor: Manufacturer: Yageo; PartNumber: RC0201JR-07100RL; ValueManufacturerPartNumber: Resistor film, 47k, ±5%, 0201, 0.05W, -55...+125°C; TypeResistor: Resistor film; Power: 0.05W; Tolerance: ±5%; Package: 0201; HelpURL: https://www.digikey.com/product-detail/en/yageo/RC0201JR-07100RL/311-100NCT-ND/1949006; Temperature: -55...+125°C
R7 R28 R68 R105 = Resistor: Manufacturer: Yageo; PartNumber: RC0201JR-07100RL; ValueManufacturerPartNumber: Resistor film, 680r, ±5%, 0201, 0.05W, -55...+125°C; TypeResistor: Resistor film; Power: 0.05W; Tolerance: ±5%; Package: 0201; HelpURL: https://www.digikey.com/product-detail/en/yageo/RC0201JR-07100RL/311-100NCT-ND/1949006; Temperature: -55...+125°C
R8 R15 R71 R86 = Resistor: Manufacturer: Yageo; PartNumber: RC0201JR-07100RL; ValueManufacturerPartNumber: Resistor film, 324r, ±5%, 0201, 0.05W, -55...+125°C; TypeResistor: Resistor film; Power: 0.05W; Tolerance: ±5%; Package: 0201; HelpURL: https://www.digikey.com/product-detail/en/yageo/RC0201JR-07100RL/311-100NCT-ND/1949006; Temperature: -55...+125°C
R10 R14 R77 R85 = Resistor: Manufacturer: Yageo; PartNumber: RC0201JR-07100RL; ValueManufacturerPartNumber: Resistor film, 226r, ±5%, 0201, 0.05W, -55...+125°C; TypeResistor: Resistor film; Power: 0.05W; Tolerance: ±5%; Package: 0201; HelpURL: https://www.digikey.com/product-detail/en/yageo/RC0201JR-07100RL/311-100NCT-ND/1949006; Temperature: -55...+125°C
R12 R16 R63 = Resistor: Manufacturer: Yageo; PartNumber: RC0201JR-07100RL; ValueManufacturerPartNumber: Resistor film, 4k7, ±5%, 0201, 0.05W, -55...+125°C; TypeResistor: Resistor film; Power: 0.05W; Tolerance: ±5%; Package: 0201; HelpURL: https://www.digikey.com/product-detail/en/yageo/RC0201JR-07100RL/311-100NCT-ND/1949006; Temperature: -55...+125°C
R17 R87 = Resistor: Manufacturer: Yageo; PartNumber: RC0201JR-07100RL; ValueManufacturerPartNumber: Resistor film, 330r, ±5%, 0201, 0.05W, -55...+125°C; TypeResistor: Resistor film; Power: 0.05W; Tolerance: ±5%; Package: 0201; HelpURL: https://www.digikey.com/product-detail/en/yageo/RC0201JR-07100RL/311-100NCT-ND/1949006; Temperature: -55...+125°C
R21 R97 = Resistor: Manufacturer: Yageo; PartNumber: RC0201JR-07100RL; ValueManufacturerPartNumber: Resistor film, open, ±5%, 0201, 0.05W, -55...+125°C; TypeResistor: Resistor film; Power: 0.05W; Tolerance: ±5%; Package: 0201; HelpURL: https://www.digikey.com/product-detail/en/yageo/RC0201JR-07100RL/311-100NCT-ND/1949006; Temperature: -55...+125°C
R22 R98 = Trimmer: Manufacturer: Bourns; PartNumber: 3296W-1-103LF; ValueManufacturerPartNumber: Resistor film, 20k, ±10%, 3296W, 0.5W, -55...+125°C; TypeResistor: Resistor film; Power: 0.5W; Tolerance: ±10%; Package: 3296W; HelpURL: https://www.digikey.com/product-detail/en/bourns-inc/3296W-1-103LF/3296W-103LF-ND/1088045; Temperature: -55...+125°C
R24 R39 = Resistor: Manufacturer: Yageo; PartNumber: RC0201JR-07100RL; ValueManufacturerPartNumber: Resistor film, 240r, ±5%, 0201, 0.05W, -55...+125°C; TypeResistor: Resistor film; Power: 0.05W; Tolerance: ±5%; Package: 0201; HelpURL: https://www.digikey.com/product-detail/en/yageo/RC0201JR-07100RL/311-100NCT-ND/1949006; Temperature: -55...+125°C
R25 R40 R104 = Resistor: Manufacturer: Yageo; PartNumber: RC0201JR-07100RL; ValueManufacturerPartNumber: Resistor film, 400r, ±5%, 0201, 0.05W, -55...+125°C; TypeResistor: Resistor film; Power: 0.05W; Tolerance: ±5%; Package: 0201; HelpURL: https://www.digikey.com/product-detail/en/yageo/RC0201JR-07100RL/311-100NCT-ND/1949006; Temperature: -55...+125°C
R26 = Resistor: Manufacturer: Yageo; PartNumber: RC0201JR-07100RL; ValueManufacturerPartNumber: Resistor film, 720r, ±5%, 0201, 0.05W, -55...+125°C; TypeResistor: Resistor film; Power: 0.05W; Tolerance: ±5%; Package: 0201; HelpURL: https://www.digikey.com/product-detail/en/yageo/RC0201JR-07100RL/311-100NCT-ND/1949006; Temperature: -55...+125°C
R30 = Resistor: Manufacturer: Yageo; PartNumber: RC0201JR-07100RL; ValueManufacturerPartNumber: Resistor film, 1K, ±5%, 0201, 0.05W, -55...+125°C; TypeResistor: Resistor film; Power: 0.05W; Tolerance: ±5%; Package: 0201; HelpURL: https://www.digikey.com/product-detail/en/yageo/RC0201JR-07100RL/311-100NCT-ND/1949006; Temperature: -55...+125°C
R31 R34-R36 R38 R42 R45 R49 R61 R72 R78-R81 R83 R95 R100 = Resistor: Manufacturer: Yageo; PartNumber: RC0201JR-07100RL; ValueManufacturerPartNumber: Resistor film, 20k, ±5%, 0201, 0.05W, -55...+125°C; TypeResistor: Resistor film; Power: 0.05W; Tolerance: ±5%; Package: 0201; HelpURL: https://www.digikey.com/product-detail/en/yageo/RC0201JR-07100RL/311-100NCT-ND/1949006; Temperature: -55...+125°C
R33 = Resistor: Manufacturer: Yageo; PartNumber: RC0201JR-07100RL; ValueManufacturerPartNumber: Resistor film, 10K, ±5%, 0201, 0.05W, -55...+125°C; TypeResistor: Resistor film; Power: 0.05W; Tolerance: ±5%; Package: 0201; HelpURL: https://www.digikey.com/product-detail/en/yageo/RC0201JR-07100RL/311-100NCT-ND/1949006; Temperature: -55...+125°C
R37 R59 = Resistor: Manufacturer: Yageo; PartNumber: RC0201JR-07100RL; ValueManufacturerPartNumber: Resistor film, 2.2R, ±5%, 0201, 0.05W, -55...+125°C; TypeResistor: Resistor film; Power: 0.05W; Tolerance: ±5%; Package: 0201; HelpURL: https://www.digikey.com/product-detail/en/yageo/RC0201JR-07100RL/311-100NCT-ND/1949006; Temperature: -55...+125°C
R41 R60 = Resistor: Manufacturer: Yageo; PartNumber: RC0201JR-07100RL; ValueManufacturerPartNumber: Resistor film, 4.7R, ±5%, 0201, 0.05W, -55...+125°C; TypeResistor: Resistor film; Power: 0.05W; Tolerance: ±5%; Package: 0201; HelpURL: https://www.digikey.com/product-detail/en/yageo/RC0201JR-07100RL/311-100NCT-ND/1949006; Temperature: -55...+125°C
R43 R53 R55 = Resistor: Manufacturer: Yageo; PartNumber: RC0201JR-07100RL; ValueManufacturerPartNumber: Resistor film, 10k, ±5%, 0201, 0.05W, -55...+125°C; TypeResistor: Resistor film; Power: 0.05W; Tolerance: ±5%; Package: 0201; HelpURL: https://www.digikey.com/product-detail/en/yageo/RC0201JR-07100RL/311-100NCT-ND/1949006; Temperature: -55...+125°C
R48 R99 = Resistor: Manufacturer: Yageo; PartNumber: RC0201JR-07100RL; ValueManufacturerPartNumber: Resistor film, 2k5, ±5%, 0201, 0.05W, -55...+125°C; TypeResistor: Resistor film; Power: 0.05W; Tolerance: ±5%; Package: 0201; HelpURL: https://www.digikey.com/product-detail/en/yageo/RC0201JR-07100RL/311-100NCT-ND/1949006; Temperature: -55...+125°C
R50 = Resistor: Manufacturer: Yageo; PartNumber: RC0201JR-07100RL; ValueManufacturerPartNumber: Resistor film, 1k8, ±5%, 0201, 0.05W, -55...+125°C; TypeResistor: Resistor film; Power: 0.05W; Tolerance: ±5%; Package: 0201; HelpURL: https://www.digikey.com/product-detail/en/yageo/RC0201JR-07100RL/311-100NCT-ND/1949006; Temperature: -55...+125°C
R52 R107 = Resistor: Manufacturer: Yageo; PartNumber: RC0201JR-07100RL; ValueManufacturerPartNumber: Resistor film, 2k8, ±5%, 0201, 0.05W, -55...+125°C; TypeResistor: Resistor film; Power: 0.05W; Tolerance: ±5%; Package: 0201; HelpURL: https://www.digikey.com/product-detail/en/yageo/RC0201JR-07100RL/311-100NCT-ND/1949006; Temperature: -55...+125°C
R56 R108 = Resistor: Manufacturer: Yageo; PartNumber: RC0201JR-07100RL; ValueManufacturerPartNumber: Resistor film, 2k2, ±5%, 0201, 0.05W, -55...+125°C; TypeResistor: Resistor film; Power: 0.05W; Tolerance: ±5%; Package: 0201; HelpURL: https://www.digikey.com/product-detail/en/yageo/RC0201JR-07100RL/311-100NCT-ND/1949006; Temperature: -55...+125°C
R65 = Resistor: Manufacturer: Yageo; PartNumber: RC0201JR-07100RL; ValueManufacturerPartNumber: Resistor film, 100k, ±5%, 0201, 0.05W, -55...+125°C; TypeResistor: Resistor film; Power: 0.05W; Tolerance: ±5%; Package: 0201; HelpURL: https://www.digikey.com/product-detail/en/yageo/RC0201JR-07100RL/311-100NCT-ND/1949006; Temperature: -55...+125°C
R73 R82 = Resistor: Manufacturer: Yageo; PartNumber: RC0201JR-07100RL; ValueManufacturerPartNumber: Resistor film, 75r, ±5%, 0201, 0.05W, -55...+125°C; TypeResistor: Resistor film; Power: 0.05W; Tolerance: ±5%; Package: 0201; HelpURL: https://www.digikey.com/product-detail/en/yageo/RC0201JR-07100RL/311-100NCT-ND/1949006; Temperature: -55...+125°C
R101 = Resistor: Manufacturer: Yageo; PartNumber: RC0201JR-07100RL; ValueManufacturerPartNumber: Resistor film, 3k, ±5%, 0201, 0.05W, -55...+125°C; TypeResistor: Resistor film; Power: 0.05W; Tolerance: ±5%; Package: 0201; HelpURL: https://www.digikey.com/product-detail/en/yageo/RC0201JR-07100RL/311-100NCT-ND/1949006; Temperature: -55...+125°C
SB1 = Button_tactile: Manufacturer: TE Connectivity; ValueManufacturerPartNumber: Tactile button, 6x6mm; PartNumber: FSM2JSMAATR; TypeButton: Tactile button; CommentText: "Кнопка"; HelpURL: https://www.digikey.com/product-detail/en/te-connectivity-alcoswitch-switches/FSM2JSMAATR/450-1792-1-ND/3503931; Package: 6x6mm
T1 = BD140C: 80V 1.5A     50MHz (BD139); Manufacturer: STMicroelectronics; Vce: 45V; TYPE: Transistors; Power: 12.5W; Ft: 60MHz; Complementary: BD139C; h21e: 63-250; Part Number: *; Mount Type: TH; Publisher: Hefest; Manufacturer Alternate: *; Published: 28.09.2019; Supplier 1: Mouser; Supplier Part Number 1: *; RoHS: Y; Technology: pnp; Package: TO126; Ic: 1.5A; ComponentLink1Description: Datasheet Link; ComponentLink1URL: https://www.onsemi.com/pub/Collateral/BD136-D.PDF; Price: *; Part Number Alternate: *; Cob: *; Value: BD140C
T2 = BD139C: 80V 1.5A     50MHz (BD140); Manufacturer: STMicroelectronics; TYPE: Transistors; Power: 12.5W; Ft: 150MHz; Complementary: BD140C; h21e: 40-250; Part Number: *; Mount Type: TH; Publisher: Hefest; Manufacturer Alternate: *; Published: 28.09.2019; Supplier 1: Mouser; Supplier Part Number 1: *; RoHS: Y; Technology: npn; Package: TO126; Vce: 80V; Ic: 1.5A; ComponentLink1Description: Datasheet Link; ComponentLink1URL: https://www.onsemi.com/pub/Collateral/BD135-D.PDF; Price: *; Part Number Alternate: *; Cob: *; Value: BD139C
T3 = Current_ZMPT107: Manufacturer: Asia; ValueManufacturerPartNumber: Transformer, 1000:1000,; PartNumber: SPDIF; TypeTransformer: Transformer; TurnsRatio: 1000:1000; HelpURL: https://aliexpress.ru/i/32958862009.html
U1 = SN74LVC244ADBRG4: Octal Buffer/Driver with 3-State Ouputs; Part Description: Octal Buffer/Driver with 3-State Outputs; Manufacturer: TEXAS INSTRUMENTS; PressFit: No; Bonding: No; Part Number: SN74LVC244ADBRG4; Component Kind: Standard; Component Type: Standard; Device: SN74LVC244ADBRG4; PackageDescription: SOP, 0.65mm Pitch; 20 pin, 5.30mm W X 7.20mm L X 2.00mm H body, IPC Medium Density; Manufacturer Part Number: SN74LVC244ADBRG4; Pin Count: 20; Case: TSSOP20; Mounted: Yes; Socket: No; SMD: Yes; Sense: No; ComponentHeight: 2mm; Author: CERN DEM JMW; HelpURL: \\cern.ch\dfs\Applications\Altium\Datasheets\SN74LVC244ADBRG4.pdf; CreateDate: 20.12.2010; LatestRevisionDate: 20.12.2010
U2 U5 U6 = ADM7150ARDZ-3.3: IC REG LINEAR 3.3V 800MA 8SOIC; Manufacturer: Analog Devices Inc; Accuracy Percentage: 1%; Capacitance: SKIP; Dropout Voltage: 0.6V; Library Path1: parts/IC_Analog_Devices_Inc_ADM7150ARDZ-3.3_eec.SchLib; Max Junction Temp: +150°C; Max Supply Voltage: 16V; Min Supply Voltage: 4.5V; Nominal Supply Current: 8.6mA; Number Of Outputs: 1; Standoff Height: 0.05mm; Value: SKIP; Verification Version: 0.0.0.1; Part Number: ADM7150ARDZ-3.3; Datasheet Path: datasheets/IC_Analog_Devices_Inc_ADM7150ARDZ-3.3_eec.pdf; Ambient Temperature Range High: +125°C; Ambient Temperature Range Low: -40°C; ComponentLink1Description: Upverter; ComponentLink1URL: https://upverter.com/upn/revision/462e4a23285522a3/; ComponentLink2Description: Datasheet; ComponentLink2URL: http://www.analog.com/media/en/technical-documentation/data-sheets/ADM7150.pdf; Datasheet Path1: datasheets/IC_Analog_Devices_Inc_ADM7150ARDZ-3.3_eec.pdf; Digikey Description: IC REG LINEAR 3.3V 800MA 8SOIC; Digikey Part Number: ADM7150ARDZ-3.3-ND; Height: 1.75mm; Inductance: SKIP; Ipc Land Pattern Name: SOIC127P600X155-8; Lead Free: yes; Library Ref1: ADM7150ARDZ-3.3; Mouser Description: LDO Voltage Regulators 800mA ULN LDO 3.3Vo; Mouser Part Number: 584-ADM7150ARDZ-3.3; Output Current: 800mA; Output Voltage: 3.3V; Package: RD-8-2; Price: 6.70290578782; Resistance: SKIP; RoHS: TRUE; Supplier 1: Digi-Key; Supplier 2: Mouser; Supplier Part Number 1: ADM7150ARDZ-3.3-ND; Supplier Part Number 2: 584-ADM7150ARDZ-3.3; Temperature: -40°C to +125°C; Temperature Range High: +125°C; Temperature Range Low: -40°C; Voltage: SKIP; helpURL: https://upverter.com/upn/revision/462e4a23285522a3/
U3 = STM32F103CBT6TR: ARM Cortex-M3 32-bit MCU, 128 KB Flash, 20 KB Internal RAM, 37 I/Os, 48-pin LQFP, -40 to 85 degC, Tape and Reel; Operating Frequency(F) (Processor speed) (MHz): 72; FLASH Size (Prog) (kB): 128; I/Os (High Current): 37; Internal RAM Size (kB): 20; Supply Voltage(Vcc) min (V): 2; A/D Converter: 2x12-bit (10 Channel); ComponentLink1Description: Manufacturer URL; ComponentLink2Description: Datasheet; Core: ARM Cortex-M3; Mounting Technology: Surface Mount; ComponentLink3URL: http://www.st.com/st-web-ui/static/active/en/resource/technical/document/datasheet/DM00058181.pdf; DatasheetVersion: Rev. 16; ComponentLink1URL: http://www.st.com/web/en/home.html; ComponentLink2URL: http://www.st.com/st-web-ui/static/active/en/resource/technical/document/datasheet/CD00161566.pdf; Packing: Tape and Reel; PackageDescription: 48-Pin Low Profile Quad Flat Package, 7 x 7 mm Body, 0.5 mm Pitch; ComponentLink3Description: Package Specification; PartNumber: STM32F103CBT6TR; PackageReference: LQFP48; PackageVersion: Rev. 6, 06/2013
U4 U7 U10 U16-U18 = AD797BRZ: Single Channel Low Noise Operational Amplifier, 8 MHz BW, 20 V/us SR, Industrial, 8-pin SOIC (R-8), Tube; Manufacturer: Analog Devices; Amplifiers Per Package: 1; Small Signal Bandwidth: 8MHz; V Span Min: 10V; Iq/Amp: 10.5mA; Input Bias Current: 250nA; V Span Max: 36V; Input Offset Voltage: 25uV; Slew Rate: 20V/us; PartNumber: AD797BRZ; Generic Part Number: AD797; ComponentLink1Description: Manufacturer URL; ComponentLink2Description: Datasheet; DatasheetVersion: Rev. H; ComponentLink3URL: http://www.analog.com/static/imported-files/packages/PKG_PDF/SOIC_Narrow%20(R)/R_8.pdf; ComponentLink3Description: Package Specification; ComponentLink1URL: http://www.analog.com/en/index.html; Code_JEDEC: MS-012-AA; ComponentLink2URL: http://www.analog.com/static/imported-files/data_sheets/AD797.pdf; PackageVersion: 060506-A; Mounting Technology: Surface Mount; PackageReference: R-8; PackageDescription: 8-Pin Standard Small Outline Package, Body 3.9 x 4.9 mm, Pitch 1.27 mm
U8 U11 = LM317AT/NOPB_v: 3-Terminal Regulator 1=Adj 2=OUT 3=IN; Part Description: 3-Terminal High-Voltage 1.2V To 37V 1.5A Positive Adjustable Regulator; Manufacturer: TEXAS INSTRUMENTS; PressFit: No; Bonding: No; Part Number: LM317AT/NOPB_v; Component Kind: Standard; Component Type: Standard; Device: LM317; PackageDescription: TO-220 3-Terminal - Vertical Mount; Manufacturer Part Number: LM317AT/NOPB; Pin Count: 3; Case: TO-220; Mounted: Yes; Socket: No; SMD: No; Sense: No; ComponentHeight: 19.55mm; HelpURL: \\cern.ch\dfs\Applications\Altium\Datasheets\LM317AT-NOPB.pdf; Author: CERN DEM JLC; CreateDate: 07.12.2010; LatestRevisionDate: 18.09.2014
U9 U15 = AD1955ARSZ: High Performance Multibit Sigma-Delta DAC with SACD Playback, 5 V Power Supply, -40 to 85 degC, 28-Pin SSOP (RS-28), RoHS, Tube; Manufacturer: Analog Devices; Voltage Supply (V): 5; Max Sampling Rate (KHz): 192; DAC THD+N @ 1 kHz (-3dB): 110; Resolution (Bits): 24; # DAC: 2; DAC DNR (dB): 123; DAC Architecture: Sigma Delta; PartNumber: AD1955ARSZ; ComponentLink1Description: Manufacturer URL; ComponentLink2Description: Datasheet; DatasheetVersion: Rev. 0; ComponentLink1URL: http://www.analog.com/; Packing: Tube; ComponentLink2URL: http://www.analog.com/static/imported-files/data_sheets/AD1955.pdf; PackageReference: RS-28; ComponentLink3Description: Package Specification; Temperature Range (degC): -40 to 85; PackageVersion: 060106-A; RoHS: TRUE; Mounting Technology: Surface Mount; PackageDescription: 28-Pin Shrink Small Outline Package, Body 10.2 x 5.3 mm, Pitch 0.65 mm; ComponentLink3URL: http://www.analog.com/static/imported-files/packages/32122249223724RS_28.pdf
U13 = Header 8: Header, 8-Pin; LatestRevisionDate: 17-Jul-2002; LatestRevisionNote: Re-released for DXP Platform.; Publisher: Altium Limited
U14 U? = TORX147: Undefined or Miscellaneous; Manufacturer_Name: Toshiba; Datasheet Link: https://datasheetspdf.com/pdf-file/928498/ToshibaSemiconductor/TOTX147/1; Height: 19.4mm; Manufacturer_Part_Number: TORX147; Mouser Part Number: N/A; Mouser Price/Stock: https://www.mouser.co.uk/ProductDetail/Toshiba/TORX147?qs=8GnAp0dDS0JS0hhE8Z5hBw%3D%3D
U19 = CS8416-CZZ: IC RCVR DGTL 192KHZ 28TSSOP COMM; Manufacturer: Cirrus Logic; Capacitance: SKIP; Library Path1: parts/IC_Cirrus_Logic_CS8416-CZZ_eec.SchLib; Value: SKIP; Part Number: CS8416-CZZ; Datasheet Path: datasheets/IC_Cirrus_Logic_CS8416-CZZ_eec.pdf; ComponentLink1Description: Upverter; ComponentLink1URL: https://upverter.com/upn/revision/6331408eeda7ffb8/; ComponentLink2Description: Datasheet; ComponentLink2URL: https://d3uzseaevmutz1.cloudfront.net/pubs/proDatasheet/CS8416_F3.pdf; Datasheet Path1: datasheets/IC_Cirrus_Logic_CS8416-CZZ_eec.pdf; Digikey Description: IC RCVR DGTL 192KHZ 28TSSOP COMM; Digikey Part Number: 598-1124-5-ND; Inductance: SKIP; Ipc Land Pattern Name: SOP65P640X105-28; Lead Free: yes; Library Ref1: CS8416-CZZ; Mouser Part Number: 777-CS8416-CZZ; Package: TSSOP28; Price: 6.36832533296; Resistance: SKIP; RoHS: TRUE; Supplier 1: Digi-Key; Supplier 2: Mouser; Supplier Part Number 1: 598-1124-5-ND; Supplier Part Number 2: 777-CS8416-CZZ; Temperature: -10°C to +70°C; Temperature Range High: +70°C; Temperature Range Low: -10°C; Voltage: SKIP; helpURL: https://upverter.com/upn/revision/6331408eeda7ffb8/
VD1-VD12 = Schottky_single: Manufacturer: Diodes Incorporated; ValueManufacturerPartNumber: Schottky diode, 80V, 500mA, 1V, 15pF, SOD-123, -55...+150°C; TypeDiode: Schottky diode; Voltage: 80V; Current: 500mA; VoltageDrop: 1V; RecoveryTime: 15pF; Package: SOD-123; HelpURL: https://www.digikey.com/product-detail/en/diodes-incorporated/MBR0580S1-7/MBR0580S1-7DICT-ND/5080371; Temperature: -55...+150°C
VT1 = BJT_NPN_132: Manufacturer: ON Semiconductor; ValueManufacturerPartNumber: NPN transistor, 45V, 100mA, 100MHz, 300mW, 0.6V, 420, SOT-23, -55...+125°C; PartNumber: BC847CLT1G; TypeTransistor: NPN transistor; VoltageCE: 45V; CurrentCE: 100mA; VoltageSaturation: 0.6V; Frequency: 100MHz; CurrentGain: 420; MaxPower: 300mW; Package: SOT-23; HelpURL: https://www.digikey.com/product-detail/en/on-semiconductor/BC847CLT1G/BC847CLT1GOSCT-ND/917836; Temperature: -55...+125°C